# EAGLE board octanis_v0.5 (EAGLE 7.2.0)
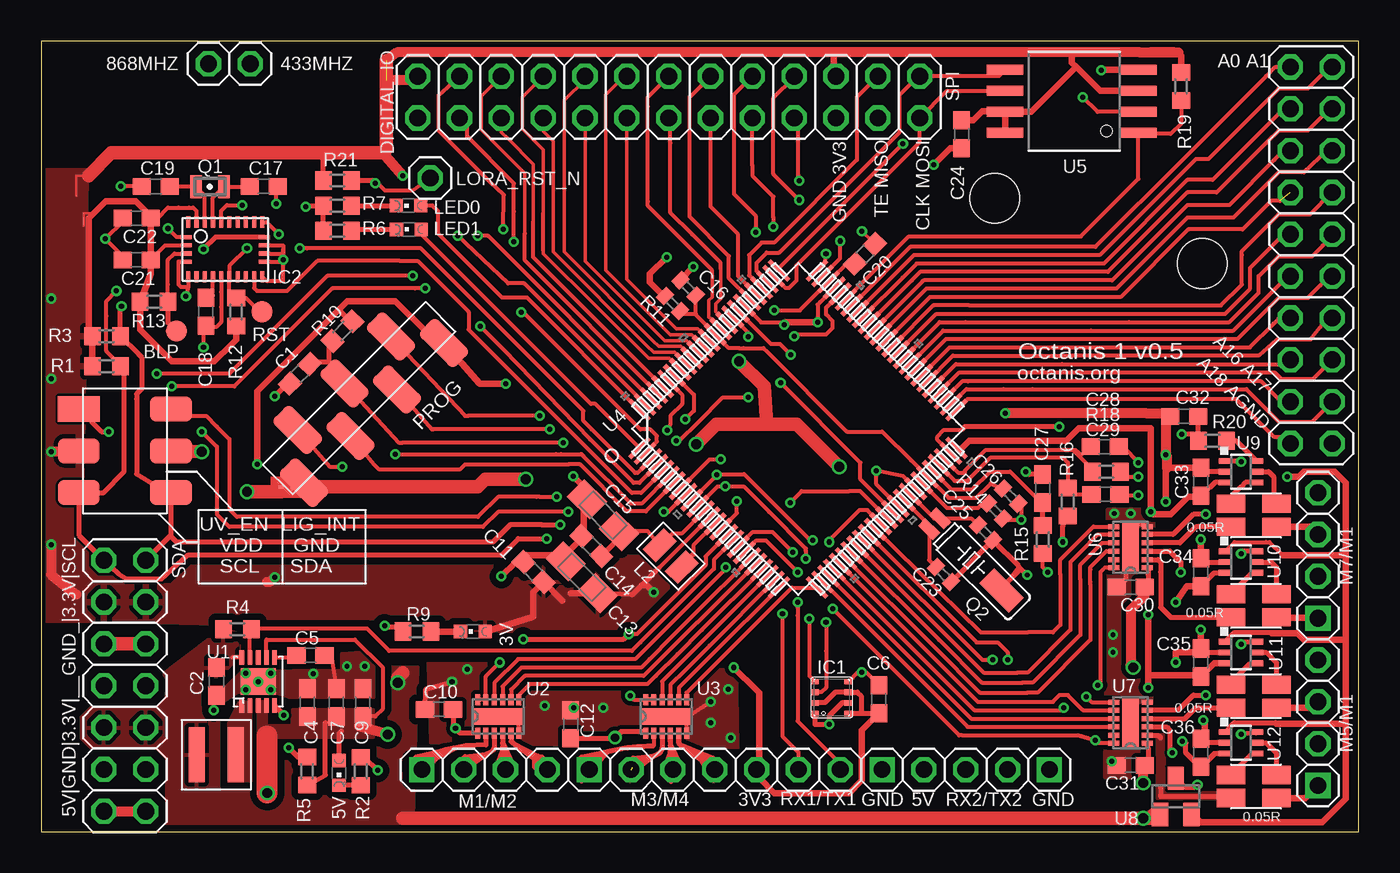
[diagram p2: board, top side]
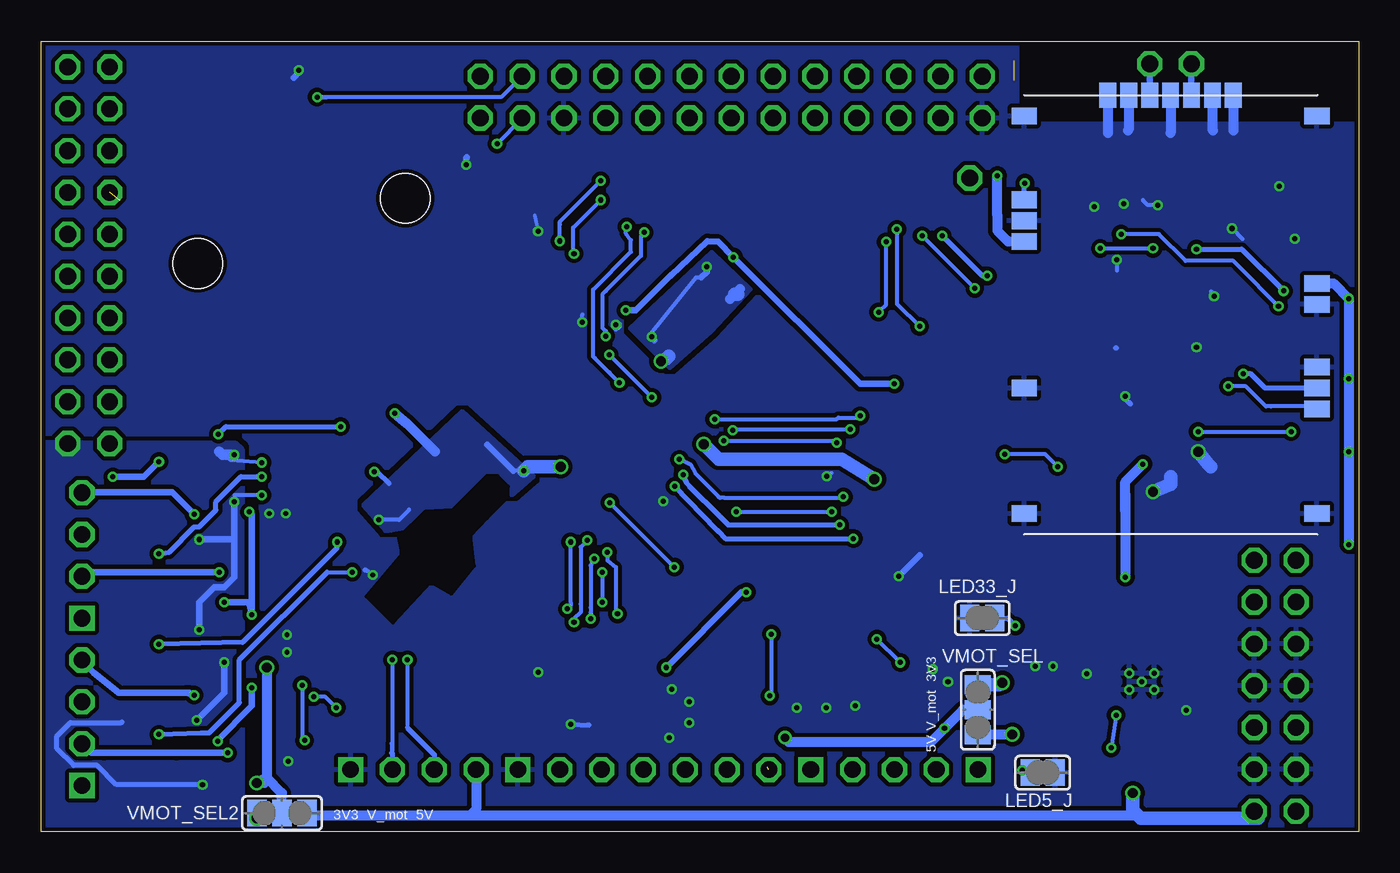
[diagram p3: board, bottom side, seen from below]

Size 80 x 48 mm. Coordinates in mm from the lower left corner, seen from the top.
Outline: 0,0 80,0 80,48 0,48 0,0
Copper layers (1*16): Top 0.035mm / dielectric 1.5mm / Bottom 0.035mm
Design rules "SeeedStudio_2layer_DRU_no_angle_20140221 *": minimum track width 8mil, minimum drill 12mil, track to track 6mil, track to pad 8mil, pad to pad 6mil, via to via 8mil, smd to smd 0mil, copper to edge 10mil, drill to drill 10mil, minimum pad ring 6mil, minimum via ring 6mil, stop-mask expansion 2mil, vias tented up to drill 100mil, thermal gap 10mil
Net classes: 0 default: width 0.203 mm; 1 power: width 0.203 mm, drill 0.305 mm, clearance 0.152 mm; 2 VIN: width 0.203 mm, drill 0.305 mm, clearance 0.152 mm; 3 fine: width 0.406 mm, drill 0.61 mm, clearance 0.152 mm
Holes 3 mm at 57.9,38.46 70.5,34.5

## Footprints (pad centres in the part's own frame; a part is rotated, then mirrored left to right if it is on the bottom)
CHIPLED_0603 = smd 0.8 x 0.8: A 0,-0.75; C 0,0.75
1X01 = drill 1.016 octagon: 1 0,0
2X10 = drill 1.016 octagon: 1 -11.43,-1.27; 2 -11.43,1.27; 3 -8.89,-1.27; 4 -8.89,1.27; 5 -6.35,-1.27; 6 -6.35,1.27; 7 -3.81,-1.27; 8 -3.81,1.27; 9 -1.27,-1.27; 10 -1.27,1.27; 11 1.27,-1.27; 12 1.27,1.27; 13 3.81,-1.27; 14 3.81,1.27; 15 6.35,-1.27; 16 6.35,1.27; 17 8.89,-1.27; 18 8.89,1.27; 19 11.43,-1.27; 20 11.43,1.27
B1,27 = smd 1.27 x 1.27: TP 0,0
C0603 = smd 1.1 x 1: 1 -0.85,0; 2 0.85,0
A/3216-18R = smd 1.95 x 1.5: + 1.375,0; - -1.375,0
C0402 = smd 0.7 x 0.9: 1 -0.65,0; 2 0.65,0
2X11 = drill 1.016 octagon: 1 -12.7,-1.27; 2 -12.7,1.27; 3 -10.16,-1.27; 4 -10.16,1.27; 5 -7.62,-1.27; 6 -7.62,1.27; 7 -5.08,-1.27; 8 -5.08,1.27; 9 -2.54,-1.27; 10 -2.54,1.27; 11 0,-1.27; 12 0,1.27; 13 2.54,-1.27; 14 2.54,1.27; 15 5.08,-1.27; 16 5.08,1.27; 17 7.62,-1.27; 18 7.62,1.27; 19 10.16,-1.27; 20 10.16,1.27; 21 12.7,-1.27; 22 12.7,1.27
BME280 = smd 0.35 x 0.5: 1 0.975,-1.025; 2 0.325,-1.025; 3 -0.325,-1.025; 4 -0.975,-1.025; 5 -0.975,1.025; 6 -0.325,1.025; 7 0.325,1.025; 8 0.975,1.025
BNO055 = smd 0.675 x 0.25: 1 1.663,2.25; 6 -1.665,2.25; 7 -1.665,1.75; 8 -1.665,1.25; 9 -1.665,0.75; 10 -1.665,0.25; 11 -1.665,-0.25; 12 -1.665,-0.75; 13 -1.665,-1.25; 14 -1.665,-1.75; 15 -1.665,-2.25; 20 1.663,-2.25; 21 1.663,-1.75; 22 1.663,-1.25; 23 1.663,-0.75; 24 1.663,-0.25; 25 1.663,0.25; 26 1.663,0.75; 27 1.663,1.25; 28 1.663,1.75 | smd 0.25 x 0.675: 2 0.75,2.362; 3 0.25,2.362; 4 -0.25,2.362; 5 -0.75,2.362; 16 -0.75,-2.362; 17 -0.25,-2.362; 18 0.25,-2.362; 19 0.75,-2.362
H2X3-SMD-2.54 = smd 2.54 x 1.524: 1 -2.794,2.54; 2 -2.794,0; 3 -2.794,-2.54; 4 2.794,-2.54; 5 2.794,0; 6 2.794,2.54
2X07 = drill 1.016 octagon: 1 -7.62,-1.27; 2 -7.62,1.27; 3 -5.08,-1.27; 4 -5.08,1.27; 5 -2.54,-1.27; 6 -2.54,1.27; 7 0,-1.27; 8 0,1.27; 9 2.54,-1.27; 10 2.54,1.27; 11 5.08,-1.27; 12 5.08,1.27; 13 7.62,-1.27; 14 7.62,1.27
XFL4020 = smd 0.965 x 3.353: P$1 -1.181,0; P$2 1.181,0
0806 = smd 1.1 x 1.8: 1 -0.94,0; 2 0.94,0
SJ = smd 1.168 x 1.6: 1 -0.762,0; 2 0.762,0
1X04-S = drill 1.016 square: 1 -3.81,0 | drill 1.016 octagon: 2 -1.27,0; 3 1.27,0; 4 3.81,0
1X7SMD = smd 3.048 x 1.524: 1 -1.27,6; 2 1.27,4; 3 -1.27,2; 4 1.27,0; 5 -1.27,-2; 6 1.27,-4; 7 -1.27,-6
FC-12M = smd 0.7 x 1.4: 1 -0.85,0; 2 0.85,0
MS3V-T1R = smd 0.635 x 1.27: P1 -0.47,-4.43; P2 0.47,-4.43 | smd 1.27 x 2.54: P3 0,1.3
R0603 = smd 1 x 1.1: 1 -0.85,0; 2 0.85,0
R0402 = smd 0.7 x 0.9: 1 -0.65,0; 2 0.65,0
4PADS_RESISTOR = smd 1.727 x 1.1: I1 0,0; I2 2.751,0; V1 0,1.4; V2 2.751,1.4
2X02 = drill 1.016 octagon: 1 -1.27,-1.27; 2 -1.27,1.27; 3 1.27,-1.27; 4 1.27,1.27
S-PVSON-N10 = smd 0.28 x 0.825: 1 -1,-1.462; 2 -0.5,-1.462; 3 0,-1.462; 4 0.5,-1.462; 5 1,-1.462; 6 1,1.462; 7 0.5,1.462; 8 0,1.462; 9 -0.5,1.462; 10 -1,1.462 | smd 2.15 x 1.6: EXPAD 0,0 | drill 0.3 pad 0.605: GND1 -0.762,0.508 | drill 0.3 pad 0.61: GND2 -0.762,-0.508; GND3 0,0; GND4 0.762,-0.508 | drill 0.305 pad 0.605: GND5 0.762,0.508
SON50P200X300X80-13N = smd 0.66 x 0.305: 1 -1.016,1.245; 2 -1.016,0.762; 3 -1.016,0.254; 4 -1.016,-0.254; 5 -1.016,-0.762; 6 -1.016,-1.245; 7 1.016,-1.245; 8 1.016,-0.762; 9 1.016,-0.254; 10 1.016,0.254; 11 1.016,0.762; 12 1.016,1.245 | smd 0.991 x 3.099: 13 0,0
PZ100 = smd 1.676 x 0.279: 1 -7.62,5.994; 2 -7.62,5.512; 3 -7.62,5.004; 4 -7.62,4.496; 5 -7.62,3.988; 6 -7.62,3.505; 7 -7.62,2.997; 8 -7.62,2.489; 9 -7.62,2.007; 10 -7.62,1.499; 11 -7.62,0.991; 12 -7.62,0.508; 13 -7.62,0; 14 -7.62,-0.508; 15 -7.62,-0.991; 16 -7.62,-1.499; 17 -7.62,-2.007; 18 -7.62,-2.489; 19 -7.62,-2.997; 20 -7.62,-3.505; 21 -7.62,-3.988; 22 -7.62,-4.496; 23 -7.62,-5.004; 24 -7.62,-5.512; 25 -7.62,-5.994; 51 7.62,-5.994; 52 7.62,-5.512; 53 7.62,-5.004; 54 7.62,-4.496; 55 7.62,-3.988; 56 7.62,-3.505; 57 7.62,-2.997; 58 7.62,-2.489; 59 7.62,-2.007; 60 7.62,-1.499; 61 7.62,-0.991; 62 7.62,-0.508; 63 7.62,0; 64 7.62,0.508; 65 7.62,0.991; 66 7.62,1.499; 67 7.62,2.007; 68 7.62,2.489; 69 7.62,2.997; 70 7.62,3.505; 71 7.62,3.988; 72 7.62,4.496; 73 7.62,5.004; 74 7.62,5.512; 75 7.62,5.994 | smd 0.279 x 1.676: 26 -5.994,-7.62; 27 -5.512,-7.62; 28 -5.004,-7.62; 29 -4.496,-7.62; 30 -3.988,-7.62; 31 -3.505,-7.62; 32 -2.997,-7.62; 33 -2.489,-7.62; 34 -2.007,-7.62; 35 -1.499,-7.62; 36 -0.991,-7.62; 37 -0.508,-7.62; 38 0,-7.62; 39 0.508,-7.62; 40 0.991,-7.62; 41 1.499,-7.62; 42 2.007,-7.62; 43 2.489,-7.62; 44 2.997,-7.62; 45 3.505,-7.62; 46 3.988,-7.62; 47 4.496,-7.62; 48 5.004,-7.62; 49 5.512,-7.62; 50 5.994,-7.62; 76 5.994,7.62; 77 5.512,7.62; 78 5.004,7.62; 79 4.496,7.62; 80 3.988,7.62; 81 3.505,7.62; 82 2.997,7.62; 83 2.489,7.62; 84 2.007,7.62; 85 1.499,7.62; 86 0.991,7.62; 87 0.508,7.62; 88 0,7.62; 89 -0.508,7.62; 90 -0.991,7.62; 91 -1.499,7.62; 92 -2.007,7.62; 93 -2.489,7.62; 94 -2.997,7.62; 95 -3.505,7.62; 96 -3.988,7.62; 97 -4.496,7.62; 98 -5.004,7.62; 99 -5.512,7.62; 100 -5.994,7.62
SOIC_8-LEAD = smd 0.61 x 2.21: CE -1.905,-2.934; RST/HOLD -0.635,5.156; SCK 0.635,5.156; SI 1.905,5.156; SO -0.635,-2.934; VDD -1.905,5.156; VSS 1.905,-2.934; WP 0.635,-2.934
MAX6001 = smd 1 x 1.4: 1 -0.95,-1.1; 2 0.95,-1.1; 3 0,1.1
SC70-6 = smd 0.35 x 0.8: 1 -0.65,-0.95; 2 0,-0.95; 3 0.65,-0.95; 4 0.65,0.95; 5 0,0.95; 6 -0.65,0.95
RN2483 = smd 1.524 x 1.016: P$1 17.78,1.27; P$6 17.78,7.62; P$7 17.78,8.89; P$8 17.78,10.16; P$11 17.78,13.97; P$12 17.78,15.24; P$20 17.78,25.4; P$28 0,25.4; P$32 0,20.32; P$33 0,19.05; P$34 0,17.78; P$41 0,8.89; P$47 0,1.27 | smd 1.016 x 1.524: P$21 12.7,26.67; P$22 11.43,26.67; P$23 10.16,26.67; P$24 8.89,26.67; P$25 7.62,26.67; P$26 6.35,26.67; P$27 5.08,26.67
STAR = smd 0.152 x 0.305: AGND 0.635,-0.635; DGND 0.635,0.635 | smd 0.305 x 0.152: GND 0.635,0
SJ_2 = smd 1.168 x 1.6: 1 -1.524,0; 2 0,0; 3 1.524,0

## Placement (x,y rotation side)
3V  3V-ok  [CHIPLED_0603]  26.21,12.16 90 top
5V  5V-ok  [CHIPLED_0603]  18.08,3.57 180 top
433MHZ  [1X01]  12.7,46.62 0 top
868MHZ  [1X01]  10.16,46.62 0 top
ANALOG  [2X10]  77.11,35 270 top
BLP  PTR1B1,27  [B1,27]  8.21,30.4 180 top
C1  1n  [C0603]  15.7,27.8 45 top
C2  22uF  [C0603]  10.64,9.12 270 top
C4  22uF  [C0603]  16.17,7.85 90 top
C5  10nF  [C0603]  16.35,10.71 0 top
C6  100n  [C0603]  50.86,8.05 90 top
C7  22uF  [C0603]  17.93,7.85 90 top
C9  3 x 22uF  [C0603]  19.53,7.85 90 top
C10  470n  [C0603]  24.16,7.44 0 top
C11  100n  [C0603]  29.9,15.77 315 top
C12  470n  [C0603]  32.13,6.52 270 top
C13  10u  [A/3216-18R]  32.82,15.46 315 top
C14  100n  [C0603]  33.4,17.34 315 top
C15  10u  [A/3216-18R]  34.11,19.22 315 top
C16  100n  [C0402]  39.28,33.03 135 top
C17  12p  [C0603]  13.51,39.18 0 top
C18  100n  [C0603]  10.01,31.56 90 top
C19  12p  [C0603]  6.96,39.18 180 top
C20  100n  [C0603]  50.01,35.09 225 top
C21  100n  [C0603]  5.79,34.72 180 top
C22  120n  [C0603]  5.79,37.26 180 top
C23  12p  [C0402]  54.79,15.62 135 top
C24  100n  [C0603]  55.88,42.34 270 top
C25  12p  [C0402]  57.33,18.16 135 top
C26  100n  [C0402]  58.86,20.37 315 top
C27  470n  [C0603]  60.81,20.84 270 top
C28  470n  [C0603]  64.57,23.38 180 top
C29  470n  [C0603]  64.62,20.49 180 top
C30  470n  [C0603]  66.14,14.85 0 top
C31  470n  [C0603]  66.14,4.03 0 top
C32  470n  [C0603]  69.39,25.21 0 top
C33  10n  [C0603]  70.41,21.25 270 top
C34  10n  [C0603]  70.41,15.76 270 top
C35  10n  [C0603]  70.41,10.28 270 top
C36  10n  [C0603]  70.41,4.79 270 top
DIGITAL_IO  [2X11]  35.56,44.61 180 top
IC1  BME280  [BME280]  47.99,8.15 270 top
IC2  BNO055A  [BNO055]  11.18,35.36 90 top
J1  [H2X3-SMD-2.54]  5.08,23.13 0 top
JP2  [2X07]  5.08,8.87 270 top
L1  1uH  [XFL4020]  10.64,4.67 0 top
L2  4.7uH  [0806]  38.23,16.73 315 top
LED0  LED0  [CHIPLED_0603]  22.3,38.02 90 top
LED1  LED1  [CHIPLED_0603]  22.33,36.57 90 top
LED5_J  [SJ]  19.19,3.59 180 bottom
LED33_J  [SJ]  22.86,12.97 0 bottom
LORA_RST_N  [1X01]  23.62,39.69 0 top
M1/M2  [1X04-S]  26.92,3.78 0 top
M3/M4  [1X04-S]  37.08,3.78 0 top
M5/M1  [1X04-S]  77.52,6.62 90 top
M7/M1  [1X04-S]  77.52,16.78 90 top
PROG  [1X7SMD]  19.3,26.33 135 top
Q1  32.768kHz  [FC-12M]  10.24,39.17 180 top
Q2  32.768kHz  [MS3V-T1R]  57.38,15.57 225 top
R1  4.7k  [R0603]  3.96,28.26 180 top
R2  1k  [R0603]  19.41,3.67 270 top
R3  4.7k  [R0603]  3.96,30.09 180 top
R4  1M  [R0603]  11.91,12.29 180 top
R5  1M  [R0603]  16.14,3.68 270 top
R6  1k  [R0603]  17.98,36.49 0 top
R7  1k  [R0603]  17.98,38.01 0 top
R9  1k  [R0603]  22.81,12.16 0 top
R10  47k  [R0603]  18.29,30.39 225 top
R11  0R  [R0402]  38.33,32.08 135 top
R12  100k  [R0603]  11.84,31.56 90 top
R13  100k  [R0603]  6.86,32.18 180 top
R14  91k 0.1% ±25 ppm/°C  [R0402]  57.94,19.48 315 top
R15  6.8k  [R0603]  60.81,17.75 270 top
R16  6.8k  [R0603]  62.33,20.03 270 top
R18  6.8k  [R0603]  64.67,21.86 0 top
R19  10k  [R0603]  69.21,45.26 90 top
R20  6.8k  [R0603]  71.12,23.74 0 top
R21  100k  [R0603]  17.98,39.54 180 top
RS1  0.05R  [4PADS_RESISTOR]  72.24,18.51 0 top
RS2  0.05R  [4PADS_RESISTOR]  72.24,13.02 0 top
RS3  0.05R  [4PADS_RESISTOR]  72.24,7.53 0 top
RS4  0.05R  [4PADS_RESISTOR]  72.24,2.05 0 top
RST  PTR1B1,27  [B1,27]  13.41,31.57 180 top
RX1/TX1  [1X04-S]  47.24,3.78 180 top
RX2/TX2  [1X04-S]  57.4,3.78 180 top
SPI  [2X02]  52.07,44.61 0 top
U1  TPS61232  [S-PVSON-N10]  13.18,9.12 0 top
U2  DRV8836DSSR  [SON50P200X300X80-13N]  27.76,7.01 90 top
U3  DRV8836DSSR  [SON50P200X300X80-13N]  37.95,7.01 90 top
U4  MSP432  [PZ100]  45.95,24.45 45 top
U5  SST25VF064C  [SOIC_8-LEAD]  63.68,44.35 90 top
U6  DRV8836DSSR  [SON50P200X300X80-13N]  66.14,17.29 180 top
U7  DRV8836DSSR  [SON50P200X300X80-13N]  66.14,6.62 180 top
U8  MAX6001SOT-23  [MAX6001]  68.88,2.15 0 top
U9  INA210  [SC70-6]  72.85,21.86 270 top
U10  INA210  [SC70-6]  72.85,16.37 270 top
U11  INA210  [SC70-6]  72.85,10.89 270 top
U12  INA210  [SC70-6]  72.85,5.4 270 top
U13  RN2483  [RN2483]  20.32,18.05 0 bottom
U$1  WEATHER_STRIP_DOCU  [WEATHER_STRIP_DOCU]  14.63,16.98 0 top
U$100  STARGND  [STAR]  15.21,21.55 270 top
VMOT_SEL  3V3 V_Motor 5V  [SJ_2]  23.14,7.41 270 bottom
VMOT_SEL2  3V3 V_Motor 5V  [SJ_2]  65.38,1.13 0 bottom

## Tracks (layer width: path | path; a pad name or v marks a point on that pad's centre or on a via)
3V3_MODULE2  (via drill 0.6)
  Top 0.254: U1.10 12.18,10.89 | U1.10 | U1.10 11.58,10.58
  Top 0.61: v66.9,0.83 67.06,0.83
  Top 0.813: U8.1 67.58,1.05 67.36,0.83 67.06,0.83 v66.9,0.83 21.95,0.83 | v21.64,9.06 21.64,9.36 21.95,9.67
  Bottom 0.61: VMOT_SEL2.1 v66.9,0.83
  Bottom 0.813: VMOT_SEL.1 21.82,8.93 v21.64,9.06
  pour Top (isolate 0.406, rank 3): 7.92,-0.09 22.56,-0.09 22.86,9.97 20.73,9.97 10.97,12.26 7.32,9.52 7.62,8.14 7.01,7.53 3.05,7.53 2.44,6.92 2.44,5.71 3.05,5.1 7.01,5.1 7.62,4.49 7.62,0.22
5VEN
  Top 0.254: U4.17 40.84,16.51 40.84,15.97 36.37,11.5 35.87,10.99 21.13,10.99 19.78,12.34 18.16,12.34 12.76,12.34 R4.1 12.68,12.29 U1.9
+3V3  (via drill 0.3)  (1 unrouted)
  Top 0.152: 2.13,39.84 2.9,39.84 2.13,39.84 | 2.13,39.84 2.13,39.08 | 2.13,39.84 2.13,38.62 | 3.2,37.56 2.59,37.56 2.59,36.8
  Top 0.254: U4.13 37.52,16.02 | 47.76,33.38 U4.73 | v44.5,31.65 46.07,31.65 U4.73 | C20.2 49.08,34.66 U4.73 | 9.43,37.44 IC2.28 9.43,37.69 9.22,37.9 8.97,37.9 8.34,37.9 7.7,37.9 7.07,37.26 C22.1 | C21.1 7.53,35.61 IC2.3 | R12.1 12.21,30.34 | C6.1 50.84,7.17 | 17.13,40.85 17.22,40.93 17.22,41.22 | 17.07,30.62 16.99,30.62
  Top 0.305: IC1.2 46.99,7.84 47.59,7.84 48.13,8.39 48.22,8.47 IC1.6 49.56,8.47 49.78,8.25 49.78,7.28 49.89,7.17 | 37.52,16.02 37.45,15.95 36.46,14.96 35.88,14.39 C13.+ | 11.73,30.61 R12.1 | 50.84,7.17 49.89,7.17 | 49.89,7.17 49.68,7.17 IC1.8 | R21.2 17.13,40.85 16.92,41.06 | R10.1 18.75,31 18.06,31.69
  Top 0.406: R11.2 37.77,32.53 36.96,33.35 36.96,33.88 v37.97,34.89 | 69.04,47.32 68.95,47.37 69.21,47.11 R19.2 | U5.WP 64.29,44.98 62.84,46.43 | 62.84,46.43 62.59,46.69 62.59,47.32 | U5.RST/HOLD 60.12,43.71 62.84,46.43 | U5.RST/HOLD U5.VDD | C24.1 56.6,43.2 57.15,43.74 58.5,43.74 U5.RST/HOLD | DIGITAL_IO.1 48.13,46 48.13,47.32 | C13.+ 32.17,14.49 | 31.64,14.03 C11.2 29.87,14.54 29.87,13.06 3V.A | v42.06,9.97 43.43,8.6 43.59,8.45 43.59,3.88 | v37.19,14.54 36.77,14.96 36.46,14.96 | 43.59,3.88 43.59,3.27 44.5,2.35 48.77,2.35 49.07,2.35 49.84,3.12 49.84,6.17 C6.1 | RX1/TX1.4 43.48,3.78 43.59,3.88 | 3.05,27.96 3.05,28.26 R1.2 R3.2 2.9,30.31 2.9,37.25 3.2,37.56 3.91,38.27 5.74,38.27 5.89,38.12 6.64,37.36 C22.1 C21.1 6.64,33.88 R13.2 6.01,30.48 7.92,28.57 10.52,28.57 11.53,29.58 11.84,29.89 R12.1 | 3.05,23.08 2.34,23.08 J1.2 2.23,23.08 | v28.19,27.19 26.62,27.19 PROG.7 | 23.43,30.29 21.49,32.22 18.59,32.22 18.06,31.69 16.99,30.62 13.11,26.74 13.11,23.69 v13.11,22.32
  Top 0.61: 20.95,46.81 21.59,47.32 22.23,47.32 48.13,47.32 62.59,47.32 66.72,47.32 67.31,47.32 | 69.04,47.32 68.77,47.32 67.31,47.32 | 68.83,47.32 67.31,47.32 | v14.17,15.46 13.87,15.15 13.72,15.15 | v0.61,17.44 0.61,15.61 2.13,14.39 | PROG.7 23.43,30.29 | 2.23,23.08 v0.61,23.08 | v21.95,39.84 20.73,41.22 | DIGITAL_IO.21 22.62,45.63 20.95,45.63
  Top 0.813: 2.9,39.84 4.27,41.22 17.22,41.22 20.73,41.22 20.95,41.44 20.95,46.81
  Bottom 0.406: v44.5,31.65 43.89,31.65 41.77,33.78 41.73,33.78 39.55,35.86 38.89,35.81 v37.97,34.89 30.27,27.19 v28.19,27.19 | v42.06,9.97 37.49,14.54 v37.19,14.54 | v0.61,23.08 0.61,23.54
  Bottom 0.61: 14.17,20.49 14.17,19.42 | 14.17,19.42 v14.17,15.46 | v0.61,17.44 v0.61,23.08 0.61,23.54 v0.61,27.5 0.61,27.8 v0.61,32.38 1.52,33.29 U13.P$12 | U13.P$34 21.29,35.83 21.95,36.49 21.95,37.41 v21.95,39.84 | 14.17,19.42 14.17,21.25 v13.11,22.32
  pour Top: 0.36,12.87 7.62,12.87 7.62,17.69 2.44,18.35 2.69,40.1 0.36,40.1
  pour Top (isolate 0.406, rank 2): 7.62,16.73 38.66,16.73 38.66,11.9 5.94,12.72
+5V  (via drill 0.6)
  Top 0.254: U1.7 13.68,11.67 19.05,11.67 20.73,9.99 20.73,7.43 20.29,7 C9.1
  Top 0.305: R5.2 17.25,3.44 17.25,6.64 | 5V.A 18.09,5.97 18.24,6.12
  Top 0.61: JP2.13 JP2.14 | v21.03,5.91 19.29,6.42
  Top 1.27: v13.72,2.35 13.72,5.81
  Bottom 0.254: 63.72,1 63.59,1
  Bottom 0.406: 6.6,1 JP2.14
  Bottom 0.61: 63.59,1 53.95,1 | 53.95,1 13.41,1 | 3.81,1.13 JP2.13 | VMOT_SEL.3 23.11,5.91 v21.03,5.91 | RX2/TX2.4 53.59,1.36 53.95,1 | 63.72,1 VMOT_SEL2.3
  Bottom 0.813: v13.72,2.35 13.72,1.31 13.41,1 13.24,0.83 6.1,0.83 6.35,1.08 JP2.14
  pour Top (no thermals): 20.16,7.37 15.24,7.37 15.24,6.42 13.65,6.42 13.65,7.85 13.18,7.85 13.18,5.78 20.16,5.78
A0
  Top 0.254: U4.69 49.62,32.37 | 49.62,32.37 50.62,33.37 | 49.62,32.37 52.77,35.51 64.01,35.51 69.34,40.85 74.37,45.88 74.93,46.43 ANALOG.1
A1
  Top 0.254: U4.68 51.5,33.52 52.98,35 64.26,35 70.1,40.85 70.87,40.85 75.13,45.11 76.91,45.11 77.67,45.88 78.23,46.43 ANALOG.2
A2
  Top 0.254: U4.67 52.3,33.64 53.15,34.5 64.52,34.5 69.6,39.58 71.12,39.58 74.88,43.34 75.44,43.89 ANALOG.3
A3
  Top 0.254: 52.86,33.48 52.59,33.21 | 52.59,33.21 U4.66 | 52.59,33.21 53.36,33.99 64.77,33.99 69.6,38.81 71.37,38.81 74.42,41.86 75.13,42.57 76.91,42.57 77.67,43.34 78.23,43.89 ANALOG.4
A4
  Top 0.254: U4.65 53.52,33.42 53.57,33.48 65.02,33.48 69.6,38.05 72.14,38.05 74.88,40.8 75.44,41.35 ANALOG.5
A5
  Top 0.254: 50.98,30.22 U4.64 53.75,32.97 65.28,32.97 69.6,37.29 72.39,37.29 75.13,40.03 76.66,40.03 78.11,41.41 78.16,41.35 ANALOG.6
A6  (1 unrouted)
  Top 0.254: 75.21,38.31 74.68,38.31 72.95,36.58 69.65,36.58 65.53,32.46 56.64,32.46 53.96,32.46 U4.63
A7
  Top 0.254: 51.7,29.52 U4.62 54.17,31.96 56.36,31.96 71.12,31.96 71.63,31.96 72.9,33.23 72.9,35 72.9,35.26 75.13,37.49 77.04,37.49 78.36,38.81 ANALOG.8
A8
  Top 0.254: U4.61 54.34,31.45 71.37,31.45 71.88,31.45 73.41,32.97 73.41,34.24 74.68,35.51 75.44,36.27 ANALOG.9
A9
  Top 0.254: U4.60 54.55,30.94 56.13,30.94 66.04,30.94 72.14,30.94 73.91,32.72 73.91,33.73 75.13,34.95 77.17,34.95 77.8,35.59 78.38,36.17 ANALOG.10
A10
  Top 0.254: U4.59 54.77,30.43 63.75,30.43 72.39,30.43 74.68,32.72 75.13,33.17 75.59,33.63 75.69,33.73 ANALOG.11
A11
  Top 0.254: U4.58 54.94,29.92 72.64,29.92 74.42,31.7 75.13,32.41 76.91,32.41 77.67,33.17 77.98,33.48 ANALOG.12
A12
  Top 0.254: U4.57 55.15,29.42 68.58,29.42 73.15,29.42 73.39,29.42 74.83,30.85 75.13,31.16 75.81,31.16 ANALOG.13
A13
  Top 0.254: U4.56 55.36,28.91 62.48,28.91 73.91,28.91 75.03,29.87 77.06,29.87 77.67,30.64 78.13,31.24 ANALOG.14
A14
  Top 0.254: U4.55 55.53,28.4 61.98,28.4 75.59,28.4 ANALOG.15
A15
  Top 0.254: U4.54 55.74,27.89 58.42,27.89 61.47,27.89 74.89,27.89 75.29,27.5 77.23,27.5 ANALOG.16
A16
  Top 0.254: ANALOG.17 75.3,26.11 74.07,27.35 56.27,27.35 55.92,27.35 U4.53
A17
  Top 0.254: U4.52 56.17,26.88 58.42,26.88 60.2,26.88 73.17,26.88 75.13,24.91 77.18,24.91 ANALOG.18
A18
  Top 0.254: U4.51 56.25,26.28 61.27,26.28 72.54,26.28 74.83,23.99 75.42,23.99 ANALOG.19
A20  (via drill 0.3)
  Top 0.254: U4.49 54.56,23.64 54.41,23.79 54.41,23.99 54.81,24.4 54.91,24.4 55.88,24.4 55.93,24.45
  Top 0.305: 70.24,23.77 R20.1 70.24,23.77 | 70.24,23.77 69.86,24.15 v69.24,24.15 | 70.24,23.77 C32.2 | v61.82,24.6 56.08,24.6 55.93,24.45
  Bottom 0.305: v69.24,24.15 68.78,24.6 v61.82,24.6
A20UNF
  Top 0.305: U9.6 72.57,23.74 R20.2
A21
  Top 0.254: U4.48 55.67,21.81 56.08,21.81 56.08,21.91 57.35,23.18 62.64,23.18 | C28.2 63.14,22.88 62.79,23.18 62.64,23.18 | R18.1 63.82,22 62.64,23.18
A21UNF  (via drill 0.3)
  Top 0.254: R18.2 65.52,21.55 v66.6,21.55
  Top 0.305: U10.6 72.89,17.02 v72.85,16.88
  Bottom 0.305: v72.85,16.88 72.24,16.98 70.71,18.51 70.41,18.51 69.39,19.52 69.39,20.03 67.87,21.55 66.9,21.55 v66.6,21.55
A22
  Top 0.254: C29.2 62.72,20.49 R16.1 62.33,22.42 62.03,22.72 61.67,22.72 57.66,22.72 56.24,21.3 55.46,21.3 U4.47
A22UNF  (via drill 0.3)
  Top 0.305: v72.85,11.39 72.89,11.54 U11.6 | v62.03,17.59 62.03,18.57 R16.2
  Bottom 0.305: v72.85,11.39 67.77,11.5 67.36,11.9 63.3,15.97 62.03,17.24 v62.03,17.59
A23
  Top 0.254: U4.46 55.25,20.79 56.54,20.79 57.61,21.86 58.83,21.86 60.44,20.25 C27.2
  Top 0.305: R15.1 C27.2 60.44,20.25
A23UNF  (via drill 0.3)
  Top 0.254: U12.6 73.76,6.01 | v61.11,15.76 60.81,16.07 R15.2
  Top 0.305: 73.76,6.01 v72.85,5.91
  Bottom 0.254: 62.64,15.76 v61.11,15.76
  Bottom 0.305: 70.31,6.01 v72.85,5.91 70.31,6.01 | 70.31,6.01 69.8,6.01 67.97,7.84 67.97,10.43 62.64,15.76
ACCEL_INT
  Top 0.254: U4.5 36.43,20.58 35.87,20.58 33.12,23.32 26.62,29.82 25.96,30.48 25.96,31.56 22.86,34.66 21.78,34.66 16.76,34.66 16.15,34.05 14.94,32.83 13.11,32.83 12.93,33.01 IC2.14
ACCEL_N_BOOTLD
  Top 0.254: R13.1 7.7,33.24 7.7,34.72 8.09,35.11 IC2.4
  Top 0.305: BLP.TP 7.71,30.9 R13.1
ACCEL_N_RST  (via drill 0.3)
  Top 0.254: U4.3 36.22,21.8 36.07,21.8 33.43,24.44 32.92,24.95 32.92,25.55 27.43,31.04 27.13,31.35 23.05,35.42 16.15,35.42 v15.7,35.42 | v12.5,35.42 11.43,34.36 IC2.11 11.43,32.45 R12.2 12.42,32.41 12.96,31.88 RST.TP
  Bottom 0.254: v15.7,35.42 v12.5,35.42
AGND  (via drill 0.3, 0.6)
  Top 0.203: C26.2 59.17,20.1 59.31,19.96
  Top 0.254: U4.40 50.71,21.09 v50.71,21.91 52.33,21.6 U4.43 | R14.2 58.47,18.94 v59.51,18.94 59.51,19.76 59.31,19.96 | U4.84 43.09,30.15 v42.94,30.04 | C29.1 65.67,20.44 v66.6,20.44 | C28.1 65.73,23.38 v66.6,22.42 | C32.1 68.33,25.21 68.28,25.26
  Top 0.305: C26.2 59.21,20.06 | 70.65,5.4 C36.1 arc90 70.65,5.4 | U12.2 70.65,5.4 | U9.2 70.65,21.86 C33.1 | C34.1 70.65,16.37 U10.2 | C35.1 70.65,10.89 U11.2 | U8.3 68.9,3.25 69.44,2.71 70.05,2.71 v70.21,2.86 | C27.1 60.01,21.69 v59.79,21.86
  Top 0.406: C16.2 38.82,33.52 v39.6,34.3 | 70.65,5.4 70.65,6.68 v70.56,6.77 | 68.89,10.89 69.95,10.89 | 69.95,10.89 70.17,10.89 C35.1 v70.41,12.26 | v68.89,10.28 68.89,10.89 | 68.89,10.89 69.95,10.89 | C34.1 v70.41,17.75 | v68.28,20.03 68.28,22.01 68.36,22.1 C33.1
  Top 0.61: v68.28,22.88 68.28,22.98 | v58.52,25.42 67.06,25.42 68.28,25.42 68.28,25.26 v68.28,22.88 | 68.36,22.1 68.36,22.79 v68.28,22.88
  Top 0.813: v39.78,23.54 41,24.76 44.04,24.76 | 44.04,24.76 43.89,27.04 v42.37,28.57 | 44.04,24.76 45.87,24.76 v48.46,22.16 | U$100.AGND 15.8,21.61 15.8,21.45 16.31,20.95 26.52,20.95 26.98,21.4 v29.41,21.4
  Bottom 0.254: v50.71,21.91 51.35,21.91 | 43.1,30.08 40.23,33.66 39.92,33.66 | 57.66,19.55 58.27,18.94 v59.51,18.94 | v66.6,20.44 68.28,20.44 v68.28,20.03 | v66.6,22.42 68.48,22.57 68.78,22.88
  Bottom 0.305: v70.21,2.86 75.44,2.86 76.61,4.03 78.03,4.03 79.05,5.04 79.05,5.81 78.23,6.62 75.13,6.62 75.08,6.67 | v59.79,21.86 59.59,21.86 58.88,21.15
  Bottom 0.406: 51.35,21.91 52.62,23.18 52.92,23.5 | v42.94,30.04 42.77,29.85 | v39.6,34.3 39.6,33.98 39.92,33.66 | v70.56,6.77 68.89,8.45 v68.89,10.28 | v70.41,17.75 69.65,17.75 68.28,17.75 | 68.28,17.75 68.28,15.46 68.89,14.85 69.49,14.85 70.41,13.94 v70.41,12.26 | 68.28,17.75 v68.28,20.03
  Bottom 0.61: 37.57,32.96 37.9,32.63 38.18,32.35 | v58.52,25.42 57.81,24.81 56.08,23.08 | v68.28,22.88 68.78,22.88 68.99,22.88 69.19,23.08
  Bottom 0.813: 37.7,32.63 37.9,32.63 | v29.41,21.4 31.39,22.62 32.46,22.62 38.41,22.62 38.86,22.62 v39.78,23.54 | v42.37,28.57 42.06,28.72 41.91,28.87 | v48.46,22.16 50.46,22.16 v50.71,21.91
  pour Bottom: 54.43,25.55 60.47,19.83 59.08,18.24 52.62,19.38 50.08,21.6
  pour Bottom: 39.28,35.24 44.3,30.58 41.85,28.13 39.31,30.32 36.88,32.94
  pour Bottom (isolate 0.254, no thermals): 68.17,23.59 78.13,23.59 79.91,23.64 79.65,-0.09 67.77,-0.19 67.77,23.18
ANT433
  Bottom 0.406: U13.P$25 433MHZ.1
ANT868
  Bottom 0.406: U13.P$23 868MHZ.1
AVCC
  Top 0.254: 39.74,31.44 39.74,31.38 U4.87 41.76,29.36 42.06,29.36 42.37,29.36 42.63,29.36 43.85,29.36 44.04,29.18 48.92,24.3 51.06,24.3 52.81,22.55 U4.45 55.09,20.27 56.78,20.27 57.64,21.14 C26.1 | 39.74,31.44 C16.1 | R11.1 38.97,31.44 39.74,31.44
CURR_SENSE_EN  (via drill 0.3)
  Top 0.254: U4.50 55.75,23.13 arc90 55.83,23.13
  Top 0.305: U12.3 71.22,4.75 | 71.22,4.75 C36.2 | 71.22,4.75 71.22,4.69 | 71.22,4.69 70.41,3.88 | 71.22,4.75 71.22,4.69 | 71.22,4.69 70.41,3.88 | U9.3 71.28,21.21 71.02,20.95 70.95,20.95 C33.2 | C34.2 71.22,15.72 U10.3 | 55.83,23.13 55.88,23.28 | 70.41,3.88 69.49,4.79 69.49,5.4 v69.29,5.5
  Top 0.406: 67.21,9.36 67.36,9.52 70.02,9.52 70.17,9.67 C35.2 71.22,10.24 U11.3 | 67.21,9.36 v67.21,8.75 | C34.2 69.56,14.91 v68.89,13.94 | v67.21,13.17 67.21,9.36 | C33.2 70.34,20.34 69.65,20.34 68.89,19.57 68.58,19.27 68.12,19.27 67.51,19.27 v67.36,19.42 67.36,22.47 67.36,24.5 66.4,24.5 62.99,24.5 62.23,23.74 56.34,23.74 55.88,23.28
  Bottom 0.406: 67.21,7.99 67.21,7.64 69.34,5.5 v69.29,5.5 | 67.21,7.99 v67.21,8.75 67.21,7.99 | v68.89,13.94 67.36,13.94 v67.21,13.17 67.21,19.27 v67.36,19.42
EXT_LIGHTNING_INT  (via drill 0.3)
  Top 0.254: U4.8 39.62,21.65 40.58,22.61 v41.25,22.61 | v31.29,20.34 30.28,20.34 30.07,20.34 27.74,20.34 26.52,19.12 11.89,19.12 11.43,19.57 11.43,23.84 10.67,24.6 10.06,25.21 8.33,25.21 J1.6
  Bottom 0.254: v31.29,20.34 arc90 31.36,20.27 32.31,20.27 35.97,20.27 38.51,20.27 38.8,20.27 38.86,20.34 40.26,21.74 40.57,22.29 41.19,22.61 v41.25,22.61
EXT_UV_EN  (via drill 0.3)
  Top 0.254: U4.9 38.08,19.42 v37.8,19.42 | v32,19.42 27.74,19.42 26.82,18.51 15.54,18.51 11.43,18.51 10.67,19.27 10.67,23.38 9.91,24.15 v9.75,24.3 | 2.44,25.52 J1.1
  Top 0.305: 2.44,25.52 3.66,24.3 v4.12,24.3
  Bottom 0.254: v37.8,19.42 v32,19.42 | v9.75,24.3 4.27,24.3 v4.12,24.3
GND  (via drill 0.3, 0.6)
  Top 0.203: 28.98,6.95 27.76,6.95 U2.13 | C20.1 50.47,35.86 v49.84,36.45
  Top 0.254: v40.64,7.89 39.35,7.03 arc90 39.19,6.88 U3.6 | U2.6 29.01,6.93 arc90 28.98,6.95 | C5.2 17.62,10.71 C7.2 | v10.48,7.37 10.48,8.33 | U4.82 43.71,30.93 45.15,30.93 v45.11,30.79 | 32.95,20.46 C15.- 32.75,19.8 32.93,20.11 | U4.15 42.24,19.35 v42.24,20.06 | 32.3,20.2 32.64,20.2 arc90 33.12,20.68 33.12,20.78 | C19.2 v4.83,39.18 | C22.2 4.95,37.05 v3.89,35.99 4.95,34.94 C21.2 | v9.86,29.43 9.86,30.65 C18.1 9.74,30.63 10.62,30.63 10.93,30.94 arc-1 IC2.10 | IC2.15 13.67,33.45 14.69,33.45 v14.69,34.72 | IC2.18 14.69,35.61 14.69,35.36 | 14.69,35.36 v14.69,34.72 | IC2.16 14.69,34.61 v14.69,34.72 | IC2.17 14.69,35.11 14.69,35.36 | IC2.6 8.93,33.41 8.94,33.09 | 8.94,33.09 v8.79,32.51 | 7.82,36.74 v7.7,36.63 8.22,36.11 IC2.2 | IC2.25 10.93,37.7 11.28,38.05 v12.2,38.05 | 48.18,33.02 U4.72 47.3,32.16 47.14,32.01 v47.14,30.94 | IC2.5 8.33,34.61 8.33,33.24 8.48,33.09 8.94,33.09 | v14.28,38.12 14.28,39.03 C17.2 | IC1.5 49.57,9.67 v49.82,9.67 50.09,9.67 C6.2 | C13.- 31.84,16.53 31.7,16.68
  Top 0.305: IC1.1 46.97,6.52 v47.84,6.52 47.84,7.03 48.63,7.82 IC1.7 | C23.1 C25.1 59.31,16.18 59.31,15.79 58.3,14.78 Q2.P3 59.4,16.05 v59.87,15.59 | C15.- 32.3,20.2 | C30.1 65.34,14.81 65.84,15.31 65.84,16.98 U6.13 66.14,18.66 67.03,18.66 U6.6 | v16.05,37.95 16.09,37.99 17.01,37.99 17.11,37.99 R7.1 R6.1 17.01,36.37 | C10.1 23.36,8.66 v24.94,9.11 | C1.1 14.94,27.2 v14.17,26.43
  Top 0.406: v47.14,30.94 46.52,30.93 45.17,30.93 v45.11,30.79 | U5.VSS 64.39,46.25 v64.36,46.23 | C24.2 55.21,41.49 v54.2,40.49 | 32.93,20.11 32.93,18.07 C14.1 32.8,17.78 31.8,16.78 31.75,16.78 | 33.12,20.78 v32.31,21.59 | C13.- 31.44,16.43 31.38,16.37 | 29.66,16.37 C11.1 28.8,16.37 v27.94,15.51 | 31.75,16.78 29.21,16.78 | 31.7,16.68 31.75,16.73 31.75,16.78
  Top 0.813: JP2.6 JP2.5 | U$100.GND U$100.DGND U$100.GND | PROG.1 14.91,21.66 U$100.GND | U$100.GND 14.57,20.64 v12.5,20.64 | J1.5 8.64,23.13 v9.75,23.08
  Bottom 0.203: v49.84,36.45 50.04,37.44
  Bottom 0.254: v32.31,21.59 32.21,21.59 32,21.8 | 44.86,30.83 44.86,30.68 44.96,30.58 | v47.14,30.94 47.14,31.4 | v14.69,34.72 14.69,34.09 | v8.79,32.51 8.97,32.82 | v7.7,36.63 7.07,35.99 | v12.2,38.05 12.8,38.05 13.11,38.35
  Bottom 0.305: 14.72,29.38 14.77,29.38 | v47.84,6.52 46.73,6.47 46.83,6.47 | v59.87,15.59 60.33,15.89 | v14.17,26.43 14.17,26.28 13.87,25.98
  Bottom 0.406: v45.11,30.79 45.11,30.58 45.11,30.69 | v64.36,46.23 64.36,46.08 64.67,45.77 | v54.2,40.49 54.2,40.9 54.15,40.95 | v27.94,15.51 26.67,16.78
  Bottom 0.61: U13.P$21 7.62,42.59 | U13.P$22 8.89,42.64 8.84,42.59 | U13.P$24 11.43,42.43 | U13.P$26 13.97,42.64 14.02,42.59 | U13.P$27 15.24,42.43
  Bottom 0.813: v12.5,20.64 11.43,21.1 11.43,21.55 | v9.75,23.08 9.14,22.32 8.99,22.16
  other vias: 30.57,7.64 34.13,7.54 32.32,7.54 40.64,6.62 16.51,9.6 18.57,10.05 64.99,4.29 65.07,11.95 65.14,19.32 66.16,19.32 65.07,10.89 25.86,9.87 41.86,5.71 41.71,8.65 19.64,10.05
  pour Bottom (isolate 0.254, rank 2): -1.37,50.13 81.42,49.45 80.82,-2.81 -1.41,-2.41
  pour Top (no thermals): 10.32,8.8 11.27,8.8 12.23,9.75 18.29,9.82 18.29,10.82 20.16,10.97 20.16,8.17 15.08,8.17 14.13,8.48 11.91,8.48 10.96,7.85 10.32,7.85
  pour Top (isolate 0.254, no thermals): 23.67,5.45 42.27,5.15 42.16,10.02 23.52,10.18
  pour Top (isolate 0.254, no thermals): 64.77,19.57 67.51,19.57 67.36,3.27 64.62,3.27
IND
  pour Top (no thermals): 12.7,7.85 12.7,3.09 11.43,3.09 11.43,6.58 12.07,7.85
LED0
  Top 0.254: U4.100 29.48,32.45 27.97,32.45 24.08,36.34 24.08,37.7 23.76,38.02 LED0.A
LED1
  Top 0.254: 23.08,36.4 LED1.A 23.08,36.27 33.38,25.98 33.65,25.98 U4.1
LORA_RST_N  (via drill 0.3)
  Top 0.254: LORA_RST_N.1 22.55,38.93 20.88,38.93 20.42,39.39 v20.27,39.39
  Top 0.305: v20.27,39.39 20.12,39.54 R21.1
  Bottom 0.305: U13.P$32 20.32,39.34 v20.27,39.39
M1IN1  (via drill 0.3)
  Top 0.254: v41.55,16.07 41.55,15.97 36.07,10.48 28.96,10.48 27.51,9.03 U2.10 | U4.38 49.73,20.68 49.07,20.68 46.16,20.68 v45.47,19.98
  Bottom 0.254: v41.55,16.07 v45.47,19.98
M1IN2
  Top 0.254: U4.20 39.63,13.18 38.25,11.8 36.94,10.48 36.42,9.97 29.26,9.97 29.16,9.97 28.02,8.83 U2.9
M2IN1
  Top 0.254: U4.21 39.85,12.72 39.83,12.72 38.41,11.29 37.04,9.93 36.58,9.46 29.36,9.46 28.53,8.63 U2.8
M2IN2
  Top 0.254: U4.22 40.12,12.26 38.64,10.79 37.32,9.47 36.81,8.96 29.67,8.96 29.01,8.3 U2.7
M3IN1
  Top 0.254: 37.7,8.07 arc-90 U3.10 37.7,9.12 38.85,10.28 40.38,11.81 U4.23
M3IN2
  Top 0.254: U4.24 40.59,11.3 39.06,9.77 38.2,8.91 U3.9
M4IN1
  Top 0.254: U4.25 40.71,10.74 39.23,9.26 38.71,8.74 U3.8
M4IN2
  Top 0.254: 39.22,8.02 U3.7 39.19,8.45 41,10.26 45.58,14.83 U4.26
M5IN1
  Top 0.254: U4.27 56.24,6.37 U7.10
M5IN2
  Top 0.254: U4.28 56.45,6.87 U7.9
M5OUT1
  Top 0.305: U7.2 67.82,5.86 67.97,5.71 | 67.97,2.66 67.97,2.2 67.97,2.15 72.14,2.15 RS4.I1
  pour Top (no thermals): 67.82,5.86 68.12,5.86 68.12,2.35 72.69,2.35 72.69,2.05 67.82,2.05
M6IN1
  Top 0.254: U4.30 56.88,7.89 61.42,7.89 61.82,8.3 62.33,8.3 63.25,7.38 U7.8
M6IN2  (via drill 0.3)
  Top 0.254: U4.29 56.66,7.38 61.98,7.38 62.18,7.59 v62.08,7.53 | v63.45,8.2 63.78,7.87 U7.7
  Bottom 0.254: v62.08,7.53 62.74,8.2 v63.45,8.2
M7IN1
  Top 0.254: U4.31 54.26,11.19 57,8.45 59.89,8.45 60.5,8.45 63.7,11.65 63.7,15 63.7,15.15 63.7,15.92 63.7,16.07 64.01,16.37 64.31,16.68 64.67,17.03 U6.10
M7IN2
  Top 0.254: U4.32 54.52,11.65 57.11,9.06 59.59,9.06 60.2,9.06 63.09,11.95 63.09,15.31 63.09,16.22 63.55,16.68 64.41,17.54 U6.9
M8IN1
  Top 0.254: U4.33 54.78,12.11 57.22,9.67 59.28,9.67 59.89,9.67 62.48,12.26 62.48,15.46 62.48,16.37 63.09,16.98 64.16,18.05 U6.8
M8IN2
  Top 0.254: U4.36 57.05,12.11 59.89,12.11 61.42,12.11 61.87,12.56 61.87,15.61 61.87,16.53 63.88,18.53 U6.7
M1234SLEEP  (via drill 0.3)
  Top 0.254: U2.12 U2.11 27,9.44 v27.84,10.28 | U4.16 40.34,16.72 40.34,16.17 36.17,12.01 v35.66,12.01 | v35.76,8.25 35.99,8.02 U3.12
  Top 0.305: U3.11 U3.12 | v29.26,11.7 35.36,11.7 v35.66,12.01
  Bottom 0.254: v27.84,10.28 v29.26,11.7 | v35.66,12.01 35.66,8.35 v35.76,8.25
M5678SLEEP  (via drill 0.3)
  Top 0.254: U6.11 U6.12 64.59,16.04 64.47,15.92 64.31,15.76 64.31,13.54 64.31,8.91 v64.16,8.91 | U7.11 U7.12 64.19,5.38 v64.01,5.55 62.94,5.86 | 62.94,5.86 55.93,5.86 55.73,5.86 v48.06,13.53 | 63.55,5.68 62.94,5.86 | U4.37 50.16,19.52 49.68,19.52 47.85,17.69 v47.85,17.59
  Bottom 0.254: v64.16,8.91 64.16,5.71 v64.01,5.55 | v47.85,17.59 47.85,13.94 47.85,13.73 v48.06,13.53
N$1
  Top 0.254: U4.12 38.88,18.11 38.33,18.11 37.73,17.5 L2.1 36.81,18.25 C15.+
  Top 0.305: 37.73,17.5 L2.1 | C15.+ 35.05,17.79 C14.2
N$2  (via drill 0.3)
  Top 0.305: 15.73,4.79 15.84,4.68 R5.1 15.61,4.53 v15.04,5.1 | U1.5 14.73,7.1 v14.73,7.08
  Bottom 0.254: v14.73,7.08 v15.04,5.1
N$4
  Top 0.406: R9.2 3V.C
N$5
  Top 0.305: R7.2 LED0.C
N$6
  Top 0.305: R6.2 18.91,36.57 LED1.C
N$7
  cutout Bottom: 53.72,16.14 53.95,17.99 52.94,19.06 51.66,20.33 51.66,20.96 52.3,21.6 52.94,21.6 55.02,19.51 56.69,19.43 58.28,17.84 58.08,16.86 60.24,14.29 58.65,12.71 56.38,15.18 55.11,14.46
N$8
  Top 0.254: U4.41 53.91,18.61 Q2.P2 53.91,16.49 C23.2
N$10
  Top 0.254: U4.42 54.21,19.03 Q2.P1 | 54.85,19.03 56.45,19.03 C25.2
  Top 0.305: 54.85,19.03 Q2.P1
N$13
  Top 0.254: U3.2 37.19,5.23 36.81,5.23 arc23 33.81,4.62
  Top 0.406: 33.81,4.62 32.82,4.49 M3/M4.1
N$14  (via drill 0.3)
  Top 0.305: R2.1 19.62,4.52 v20.42,3.72
  Bottom 0.305: v20.42,3.72 20.42,3.75 LED5_J.2
N$15
  Top 0.305: U12.5 74.37,5.4 74.98,4.79 RS4.V2
N$16
  Top 0.305: 37.16,5.2 35.61,5.1 | 35.61,5.1 34.37,4.85 32.82,3.09 | 35.61,5.1 33,4.54 34.32,4.85 33.05,3.78 33.91,4.44 33.1,3.63
N$17
  Top 0.305: U12.4 73.54,4.75 RS4.V1
N$18
  Top 0.254: C18.2 10.43,32.56 IC2.9
N$19
  Top 0.254: IC2.27 9.93,38.63 Q1.2 7.92,39.17 C19.1
N$21
  Top 0.406: RS4.I2 76.76,2.05 M5/M1.1
N$23
  Top 0.305: U11.4 73.74,10.18 73.36,10.18 72.24,9.06 RS3.V1
N$24
  Top 0.305: U11.5 74.37,10.89 74.99,10.27 RS3.V2
N$25
  Top 0.305: 71.93,7.53 RS3.I1 70.26,7.53 70.1,7.53 69.44,6.87 U7.4
N$26  (via drill 0.3)
  Top 0.305: v20.85,12.51 20.96,12.46 21.65,12.46 R9.1
  Bottom 0.305: LED33_J.2 21.31,12.97 v20.85,12.51
N$27
  Top 0.406: RS3.I2 77.17,7.53 M5/M1.3
N$28
  Top 0.305: U10.5 74.68,16.37 74.99,16.06 RS2.V2
N$29
  Top 0.305: RS2.V1 73.54,15.72 U10.4
N$30
  Top 0.305: U9.5 74.52,21.86 74.83,21.55 74.83,20.07 RS1.V2
N$31
  Top 0.305: U9.4 73.11,21.21 72.85,20.95 72.39,20.49 72.39,20.06 RS1.V1
N$32
  Top 0.406: 75.02,12.99 77.5,12.99 M7/M1.1
  Top 0.61: RS2.I2 75.02,12.99
N$33
  Top 0.254: U4.44 54.98,19.66 56.88,19.66 57.31,20.09 R14.1
N$34
  Top 0.254: U4.14 39.6,17.39 39.6,16.84
  Top 0.305: 39.6,16.84 38.99,16.23 L2.2
N$35
  Top 0.305: RS1.I1 70.1,18.51 69.49,17.9 69.14,17.54 U6.4
N$36
  Top 0.305: RS2.I1 68.58,13.02 67.97,13.63 67.97,15.76 67.97,16.37 67.82,16.53 U6.2
N$37
  Top 0.406: RS1.I2 77.06,18.51 M7/M1.3
N$38  (via drill 0.3)
  Top 0.305: U7.3 68.33,6.37 68.53,6.16 68.53,4.89 v68.68,4.79
  Bottom 0.305: v68.68,4.79 71.78,4.79
  Bottom 0.406: v68.68,4.79 71.78,4.79 76.2,4.79 76.96,4.79 M5/M1.2
N$39  (1 unrouted)
  Top 0.305: U3.3 37.7,5.08 37.54,4.77 35.92,3.91
N$40
  Top 0.305: 38.25,3.04 38.24,3.88 U3.4
  Top 0.406: M3/M4.3 38.24,3.88
N$41
  Top 0.305: 40.69,4.16 38.81,5.28 38.71,5.38 U3.5
  Top 0.406: 40.69,4.16 M3/M4.4
N$42
  Top 0.254: U1.6 15.5,10.58 C5.1
N$43  (via drill 0.3)
  Top 0.305: U7.5 69.04,7.38 69.19,7.53 69.95,8.3 v70.71,8.3
  Bottom 0.406: 71.17,8.45 75.29,8.45 76.81,9.67 77.45,10.28 77.45,10.36 M5/M1.4 | 71.17,8.45 71.02,8.45 71.17,8.45 | 71.17,8.45 v70.71,8.3
N$44
  Top 0.305: R2.2 5V.C
N$45  (via drill 0.3)
  Top 0.305: v70.71,19.27 69.95,19.27 68.89,18.2 68.73,18.05 U6.5
  Bottom 0.406: v70.71,19.27 72.05,20.61 77.5,20.61 M7/M1.4
N$49
  Top 0.305: U2.2 27,5.28 25.81,5.23 | 25.81,5.23 24.56,4.97 | 25.81,5.23 22.89,4.57 24.51,4.97 22.48,3.75 24.11,4.57 23.29,3.75
  Top 0.406: 23.29,3.75 22.76,4.49 M1/M2.1
N$50
  Top 0.305: U2.3 27.51,5.13 27.41,4.92 27.05,4.72 | 27.05,4.72 25.73,3.75 25.73,4.16 | 25.73,4.16 25.73,4.49 25.73,4.57 27.05,4.72 | 27.05,4.72 25.73,4.16
  Top 0.406: M1/M2.2 25.73,4.49
N$51
  Top 0.305: U2.4 28.02,5.38 | 28.02,5.38 28.02,4.16 27.76,4.16 27.97,4.77 | 27.97,4.77 28.17,4.97 | 28.17,4.97 28.02,5.38 | 28.02,5.38 28.58,4.16 28.17,4.16 28.17,4.97 | 28.02,5.38 27.97,4.77
  Top 0.406: 28.17,4.16 M1/M2.3
N$52
  Top 0.305: U2.5 28.53,5.48 30,4.36 28.63,5.38 30.15,4.59 29.69,4.72
  Top 0.406: 30,4.36 30,3.95 30.07,3.88 30.07,4.49 30.38,4.49 M1/M2.4
N$54  (via drill 0.3)
  Top 0.305: U6.3 68.53,17.03 69.19,16.37 v69.19,15.76
  Bottom 0.406: v69.19,15.76 77.27,15.76 M7/M1.2
N$57
  Top 0.305: 25.27,5.13 22.68,3.8 22.48,4.16
N$59
  Top 0.305: 37.7,5.89 37.7,5.02 37.59,4.82 37.24,4.62 | 37.24,4.62 35.92,3.65 35.92,4.06 | 35.92,4.06 35.92,4.46 37.24,4.62 | 37.24,4.62 35.92,4.06 | 35.92,4.06 35.74,3.12
N$60
  Top 0.305: 38.2,5.89 38.2,5.28 | 38.2,5.28 38.2,4.06 37.95,4.06 38.15,4.67 | 38.15,4.67 38.35,4.87 | 38.35,4.87 38.2,5.28 | 38.2,5.28 38.76,4.06 38.35,4.06 38.35,4.87 | 38.2,5.28 38.15,4.67 | 38.15,4.67 38.28,3.12
N$61
  Top 0.305: 38.71,5.89 38.71,5.38 40.18,4.26 38.81,5.28 40.79,4.46 39.88,4.62 40.82,3.12
N$73
  Top 0.254: IC2.26 10.43,38.51 Q1.1 12.56,39.17 C17.1
N$76  (via drill 0.3)
  Top 0.254: U4.94 39.62,26.54 39.62,25.55 v39.12,25.05 | v30.28,25.25 25.91,25.25 25.74,25.25 PROG.6
  Bottom 0.254: v39.12,25.05 31.7,25.05 31.6,25.15 30.38,25.15 v30.28,25.25
N$77  (via drill 0.3)
  Top 0.254: U4.95 38.91,26.54 38.91,25.96 38.2,25.25 38.2,24.74 v38,24.39 | v30.89,24.44 23.77,24.44 23.72,24.44 PROG.5
  Bottom 0.254: v38,24.39 37.8,24.44 v30.89,24.44
P1.0  (via drill 0.3)
  Top 0.254: U4.4 36.32,21.19 35.97,21.19 33.33,23.83 28.09,29.26 v26.67,30.69 | v28.04,36.58 28.09,38.66 27.28,39.42 24.13,42.57 24.13,44.71 24.69,45.22 DIGITAL_IO.19
  Bottom 0.254: v28.04,36.58 28.04,32.06 v26.67,30.69
P3.7  (via drill 0.3)
  Top 0.254: U4.39 | U4.39 49.73,21.39 49.73,22.42 v44.89,27.26 | 43.38,42.98 43.18,43.18 DIGITAL_IO.6 43.18,40.44 43.18,39.83 44.45,38.56 44.45,37.29 44.45,36.83 v44.45,36.73
  Bottom 0.254: v44.89,27.26 45.5,27.87 46.38,28.76 46.48,28.86 46.48,32.92 44.2,35.21 44.2,35.92 44.5,36.33 44.5,36.68 v44.45,36.73
P5.7  (via drill 0.3)
  Top 0.254: DIGITAL_IO.5 42.06,44.76 42.06,38.73 43.38,37.41 v43.38,36.39 | v45.72,30.09 45.82,30.19 47.24,30.19 47.65,30.19 48.06,30.6 48.06,31 47.65,31.41 47.65,31.82 47.75,31.92 47.85,32.02 48.5,32.66 U4.71
  Bottom 0.254: v43.38,36.39 43.59,36.19 43.59,35.07 43.59,34.97 45.72,32.83 45.92,32.63 45.92,30.6 45.72,30.39 v45.72,30.09
P6.6
  Top 0.254: U4.80 42.32,33.73 42.32,36.27 40.64,37.95 40.64,41.51 DIGITAL_IO.8
P6.7
  Top 0.254: U4.81 41.76,33.6 41.76,34.95 39.37,37.34 39.37,44.6 DIGITAL_IO.7
P7.0
  Top 0.203: U4.88 39.87,30.53 39.17,30.53 38.56,30.53 36.83,32.26 35.56,33.53 35.56,41.86 DIGITAL_IO.12
P7.1
  Top 0.203: U4.89 39.51,30.18 38.51,30.18 38.2,30.18 37.9,30.48 34.29,34.09 34.29,44.76 35.41,45.88 DIGITAL_IO.11
P7.2
  Top 0.203: U4.90 39.18,29.82 38.2,29.82 37.85,29.82 37.49,30.18 33.02,34.65 DIGITAL_IO.14
P7.3
  Top 0.203: U4.91 38.82,29.47 37.8,29.47 37.49,29.47 37.13,29.82 31.75,35.21 31.75,44.4 33.02,45.67 DIGITAL_IO.13
P9.2  (via drill 0.3)
  Top 0.254: 48.62,35.77 v48.51,35.87 48.51,34.81 U4.74 | v46.02,39.52 45.97,39.83 45.97,43.34 DIGITAL_IO.4
  Bottom 0.254: 46.13,39.42 v46.02,39.52 48.51,37.04 48.51,36.88 v48.51,35.87
P9.3  (via drill 0.3)
  Top 0.254: U4.75 47.6,34.58 v47.65,35.11 | v46.02,38.36 44.45,39.93 44.45,44.55 45.72,45.82 DIGITAL_IO.3
  Bottom 0.254: v47.65,35.11 arc-90 47.7,35.21 47.7,36.68 v46.02,38.36
P9.4
  Top 0.203: 29.87,37.04 29.87,40.54 28.35,42.06 27.94,42.47 DIGITAL_IO.18
  Top 0.254: U4.96 29.87,34.9 29.87,37.04
P9.5
  Top 0.203: 29.36,36.33 29.36,39.98 26.72,42.62 26.72,44.66 DIGITAL_IO.17
  Top 0.254: U4.97 29.36,34.69 29.36,36.33
P10.2  (via drill 0.3)
  Top 0.254: U4.2 37.39,23.69 37.39,24.03 36.98,24.44 36.37,24.44 29.26,31.55 v29.16,31.55 | v28.7,35.82 28.7,37.65 28.7,39.37 25.86,42.22 25.86,42.88 DIGITAL_IO.20
  Bottom 0.254: v29.16,31.55 29.06,31.65 28.7,32.01 v28.7,35.82
PJ.2
  Top 0.203: U4.85 40.95,31.58 40.95,32.06 41.25,32.36 41.25,34.19
  Top 0.254: 38.2,41.81 38.2,42.83 | 38.2,42.83 38.2,43.34 DIGITAL_IO.10 | 41.25,34.19 41.25,34.55 39.52,36.27 38.2,37.59 38.2,42.83
PJ.3
  Top 0.203: 40.74,34.09 40.74,32.46 40.54,32.26 40.54,31.24 40.62,31.17 40.64,31.17 U4.86
  Top 0.254: DIGITAL_IO.9 36.83,44.6 36.83,44.05 36.83,38.26 36.83,38 39.52,35.31 40.64,34.19 40.74,34.09
PJ.4
  Top 0.203: U4.92 38.46,29.11 37.29,29.11 37.19,29.11 36.78,29.52 31.09,35.21 31.09,41.91 30.48,42.52 DIGITAL_IO.16
PJ.5
  Top 0.203: U4.93 38.13,28.76 37.03,28.76 36.88,28.76 30.48,35.11 30.48,36.22 | 30.48,37.54 30.48,41.41 29.21,42.67 29.21,44.6 DIGITAL_IO.15
  Top 0.254: 30.48,35.31 30.48,36.22 30.48,37.54
RFGND
  cutout Bottom (isolate 0.813): 0,48.53 20.32,48.53 20.32,43.45 0,43.45
RST_N  (via drill 0.3)
  Top 0.254: U4.83 44.31,29.62 44.86,29.62 v45.52,28.96 | v31.7,23.62 21.95,23.62 21.7,23.62 PROG.4 | v42.93,26.37 41.66,26.37 41.39,26.37 39.93,24.91 38.75,23.73 v38.56,23.73
  Top 0.305: PROG.4 17.49,28.5 | 17.49,28.5 16.39,28.5 C1.2 | 17.49,28.5 17.49,29.6 R10.2
  Bottom 0.254: v31.7,23.62 31.8,23.73 v38.56,23.73 | v45.52,28.96 v42.93,26.37
RX0  (via drill 0.3)
  Top 0.254: U4.6 36.45,19.92 35.81,19.92 32.92,22.81 arc16 32.77,22.93 | PROG.2 17.51,22.16 v18.29,22.16 | 31.24,22.93 31.55,22.93 | 31.55,22.93 32.77,22.93 | 32.77,22.93 32.8,22.93 | v21.49,22.93 31.55,22.93
  Bottom 0.254: v18.29,22.16 19.05,22.93 v21.49,22.93
RX1  (via drill 0.3)
  Top 0.254: U4.18 43.22,18.2 43.59,18.2 44.4,18.2 v45.62,16.98 | RX1/TX1.3 45.97,4.84 45.01,5.81 v45.01,13.22
  Bottom 0.254: v45.62,16.98 45.62,16.48 45.11,16.07 45.11,13.53 v45.01,13.22
RX2  (via drill 0.3)
  Top 0.254: U4.34 57.14,10.43 v57.76,10.43
  Bottom 0.254: v57.76,10.43 57.76,6.32
  Bottom 0.305: 57.76,6.32 56.13,4.69 RX2/TX2.3
RX3  (via drill 0.3)
  Top 0.254: U4.98 27.26,36.07 27.14,36.19 v26.52,36.19 | v23.32,32.98 22.71,32.98 17.68,32.98 11.73,27.04 v7.92,27.04
  Bottom 0.254: v26.52,36.19 23.62,33.29 v23.32,32.98 | U13.P$6 2.69,25.82 5.33,25.82 5.64,25.82 6.86,27.04 v7.92,27.04
SCL  (via drill 0.3)
  Top 0.254: U4.11 41.07,20.98 v41.53,20.98 42.49,20.98 42.64,20.98 44.2,19.42 46.43,17.19 46.43,17.03 v46.43,16.58 | v46.63,12.92 46.63,9.46 IC1.4 | R1.1 4.81,28.32 3.96,29.18 3.96,31.31 3.96,32.22 v4.57,32.83
  Top 0.305: v30.68,17.8 28.96,17.8 27.94,16.78 8.89,16.78 7.3,15.34 5.94,15.34 5.18,15.34 4.72,15.65 JP2.1 2.29,18.01 J1.3 3.81,20.59 5.03,21.86 5.03,22.16 5.03,28.11 5.08,28.26 R1.1 4.81,28.09 | IC2.19 10.59,36.11 v9.86,35.37
  Bottom 0.254: v46.43,16.58 46.63,16.17 46.63,13.63 46.63,13.33 v46.63,12.92 | 38.9,18.24 38.86,18.2
  Bottom 0.305: v41.53,20.98 38.99,18.33 38.9,18.24 | 38.86,18.2 38.45,17.8 v30.68,17.8 | v9.86,35.37 7.11,35.37 v4.57,32.83
SDA  (via drill 0.3)
  Top 0.203: 41.02,21.65 v41.02,21.69 41.02,21.65
  Top 0.254: U4.10 41.02,21.65 | IC2.20 13.7,37.02 v14.43,36.29 | v47.65,12.72 47.65,10.99 47.65,8.75 47.37,8.47 IC1.3 | v41.02,21.69 41.04,21.71 42.67,21.71 46.69,17.69 v46.84,17.69
  Top 0.305: v31.52,18.64 30.41,18.64 28.48,18.64 27.43,17.59 8.23,17.59 7.84,17.98 | 7.84,17.98 JP2.2 | 7.84,17.98 7.87,18.01 7.87,19.27 J1.4 6.99,20.59 6.99,20.97 5.79,21.71 5.79,26.28 5.79,26.58 6.1,26.89 6.1,28.81 5.94,28.96 R3.1 4.81,31.85 v4.88,31.92
  Bottom 0.254: 14.43,36.13 v14.43,36.29 12.14,36.29 10.52,34.66 7.62,34.66 7.32,34.36 v4.88,31.92 | v46.84,17.69 47.24,17.29 47.24,13.83 47.24,13.33 47.65,12.92 v47.65,12.72
  Bottom 0.305: v41.02,21.69 40.82,21.19 40.62,20.96 38.81,19.15 38.51,18.85 38.3,18.64 v31.52,18.64 | 14.38,36.34 v14.43,36.29
SPI_EXTSLAVE_TE  (via drill 0.3)
  Top 0.254: U4.76 44.8,34.24 50.14,39.58 v52.32,41.76
  Bottom 0.254: v52.32,41.76 SPI.1
SPI_FLASH_CS
  Top 0.254: R19.1 69.21,43 68.58,42.37 67.31,42.37 66.69,42.37 U5.CE 66.62,39.64 63.12,36.15 52.69,36.15 U4.70
SPI_MISO  (via drill 0.3)
  Top 0.254: SPI.2 49.53,44.6 49.53,42.47 49.53,40.8 44.5,35.77 43.74,35.77 42.98,35 42.98,33.78 U4.79 | U5.SO 64.14,43.71 v63.25,44.6
  Bottom 0.254: SPI.2 52.07,44.6 55.17,44.6 62.64,44.6 | 62.64,44.6 v63.25,44.6 | v63.25,44.6 63.4,44.6 | v63.25,44.6 62.64,44.6
SPI_MOSI
  Top 0.254: U4.78 43.43,34.05 43.43,34.55 44.04,35.16 44.81,35.16 52.12,42.47 52.12,44.76 53.24,45.88 SPI.4 58.15,45.88 U5.SI
SPI_SCK
  Top 0.254: U4.77 45.18,33.02 45.26,33.02 45.41,33.02 45.87,33.48 45.87,34.39 53.34,41.86 SPI.3 54.99,44.98 U5.SCK
TX0
  Top 0.254: U4.7 36.72,19.46 35.56,19.46 32.72,22.3 32,22.3 25.74,22.3 25.45,22.01 20.49,22.01 20.2,22.3 PROG.3
TX1  (via drill 0.3)
  Top 0.254: U4.19 43.43,17.69 43.48,17.69 43.59,17.69 43.99,17.69 v45.92,15.76 | v45.92,13.94 45.92,13.63 45.92,13.12 45.92,6.72 47.24,5.4 48.51,4.13 RX1/TX1.2
  Bottom 0.254: v45.92,15.76 v45.92,13.94
TX2  (via drill 0.3)
  Top 0.254: U4.35 56.79,11.5 58.06,11.5 58.67,10.89 v58.67,10.43
  Bottom 0.254: 58.73,5.35 58.73,4.79 58.67,4.84 58.67,6.62 v58.67,10.43
  Bottom 0.305: 58.73,4.79 58.67,4.74 RX2/TX2.2
TX3  (via drill 0.3)
  Top 0.254: U4.99 29.32,33.29 28.35,33.29 v25.3,36.19 | v22.55,33.75 17.37,33.75 11.43,27.8 v7.01,27.8
  Bottom 0.305: U13.P$7 5.69,26.94 6.4,27.65 6.55,27.8 v7.01,27.8 | v22.55,33.75 22.86,33.75 v25.3,36.19
V_MOTOR  (via drill 0.3, 0.5)
  Top 0.305: U3.1 36.7,6.08 35.21,6.08 v34.84,5.72 34.8,5.67 C12.2 | U2.1 25.44,5.99 v25.16,6.27 25.01,6.42 C10.2
  Bottom 0.305: 34.7,5.77 v34.84,5.72 34.84,5.66 34.63,5.44 | v25.16,6.27 24.9,6.53
  Bottom 0.61: 34.63,5.44 26.3,5.44 25.99,5.44 v25.16,6.27 24.9,6.53 24.02,7.41 VMOT_SEL.2
V_MOTOR2  (via drill 0.6)
  Top 0.305: U6.1 67.21,15.99 67.21,15.61 67.21,15.15 67.06,15 66.9,15 | U7.1 67.16,5.15 67.21,5.1 67.21,4.25 C31.2
  Top 0.61: C30.2 66.9,14.85 66.9,15 | C30.2 66.99,14.63 | v66.29,9.97 66.14,10.12 66.14,13.48 66.45,13.78 66.99,14.33 C30.2 | v66.9,2.96 66.9,3.94 C31.2
  Bottom 0.61: v66.29,9.97 66.29,3.27 | 66.29,3.27 v66.9,2.96 66.44,2.96 | VMOT_SEL2.2 65.38,2.35 66.29,3.27
VREF_M  (via drill 0.3)
  Top 0.254: U12.1 71.83,6.05 | U10.1 72.47,17.59 74.37,17.59 74.57,17.59 75.39,16.78
  Top 0.305: v72.85,22.47 72.81,22.51 U9.1 | 74.98,6.57 74.93,6.62 72.44,6.62 72.24,6.39 U12.1 | U11.1 72.47,12.11 74.07,12.11 74.68,12.11 arc-90 74.73,12.06
  Top 0.406: U8.2 69.93,1.05 70.41,0.57 77.78,0.57 79.2,2 79.2,6.67 | 79.2,6.67 79.2,11.7 | 79.2,11.7 79.2,16.73 | 79.2,16.73 79.2,21.2 78.54,21.86 76.66,21.86 76.35,21.55 v75.64,21.55 | 75.39,16.78 79.15,16.78 79.2,16.73 | 74.98,6.57 79.1,6.57 79.2,6.67 | 74.73,12.06 76.25,12.06 76.66,11.65 79.15,11.65 79.2,11.7
  Bottom 0.406: v75.64,21.55 73.76,21.55 v72.85,22.47

## Text on the board
tNames: A0 A1 | GND 3V3 | TE MISO | CLK MOSI | Octanis 1 v0.5 | A16 A17 | A18 AGND | octanis.org | SDA | 3V3 | GND | 5V | GND | 5V|GND|3.3V|__GND_|3.3V|SCL
bNames: 5V V_mot 3V3 | 3V3 V_mot 5V
tValues: HMC5883L